# EAGLE design iot-gateway-usb-pd (EAGLE 9.6.1)
CNAME: PepeTech; CREVISION: 1.0; DESIGNER: Joao Silva
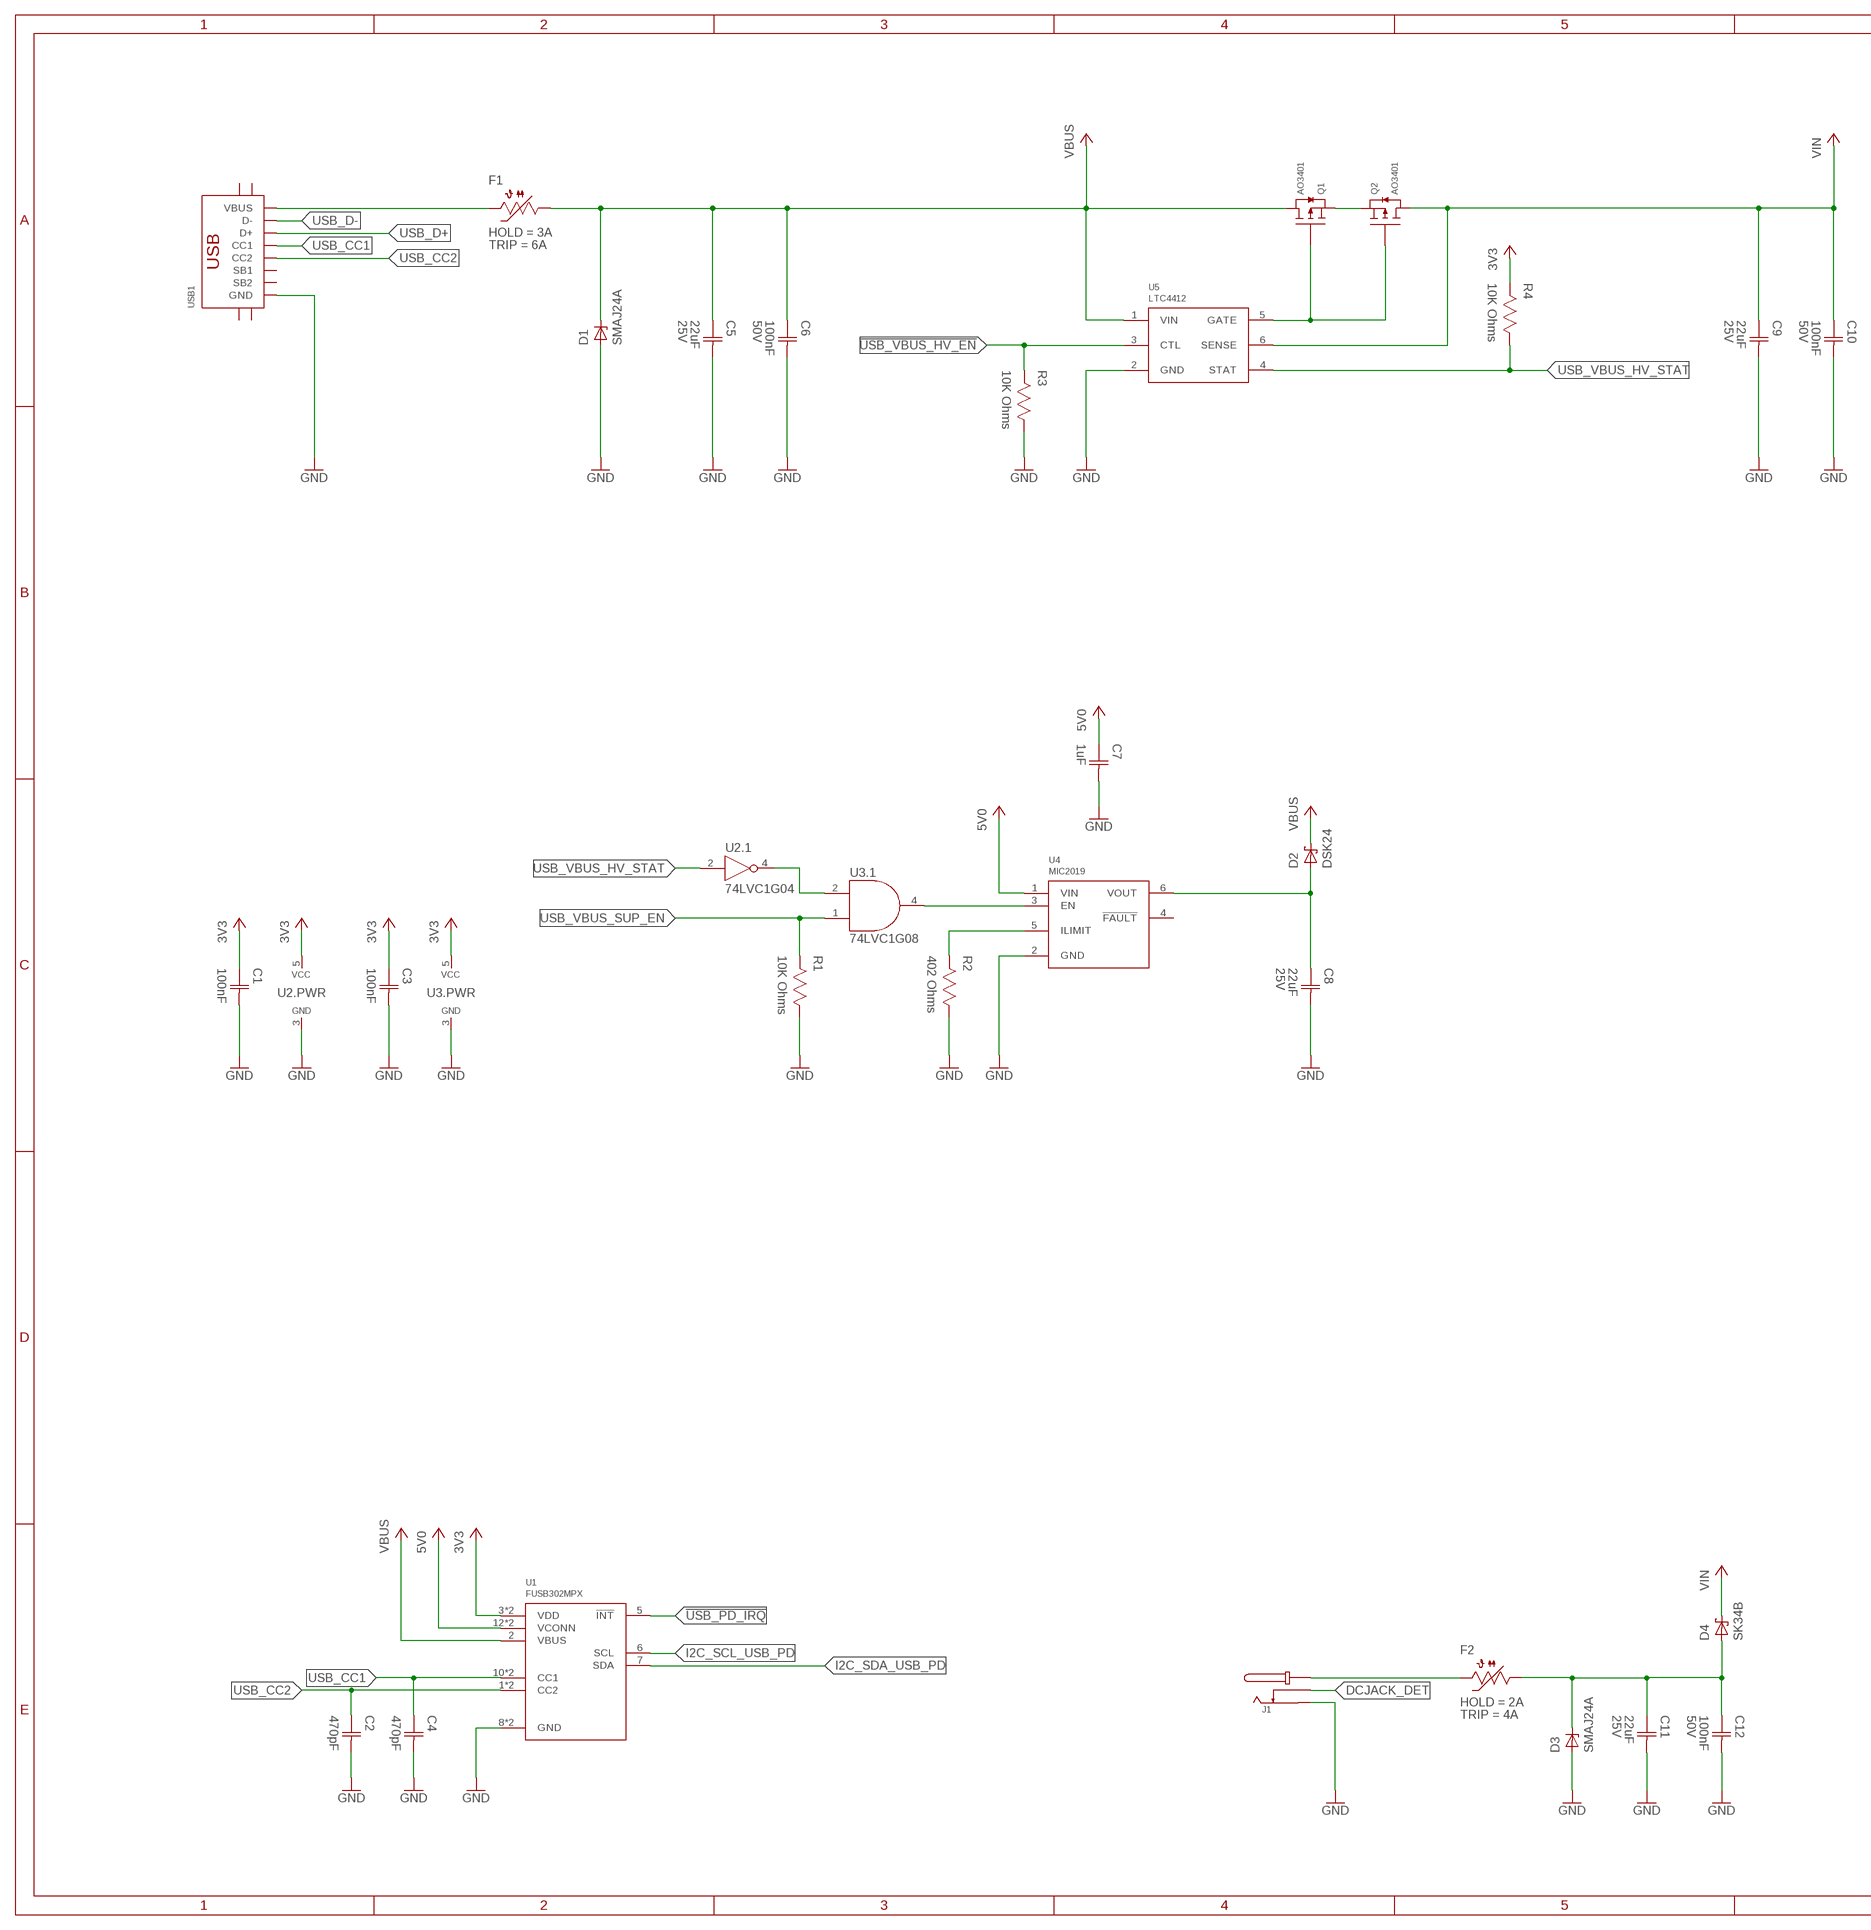
[diagram p0: schematic, sheet 1, part 1 of 2]
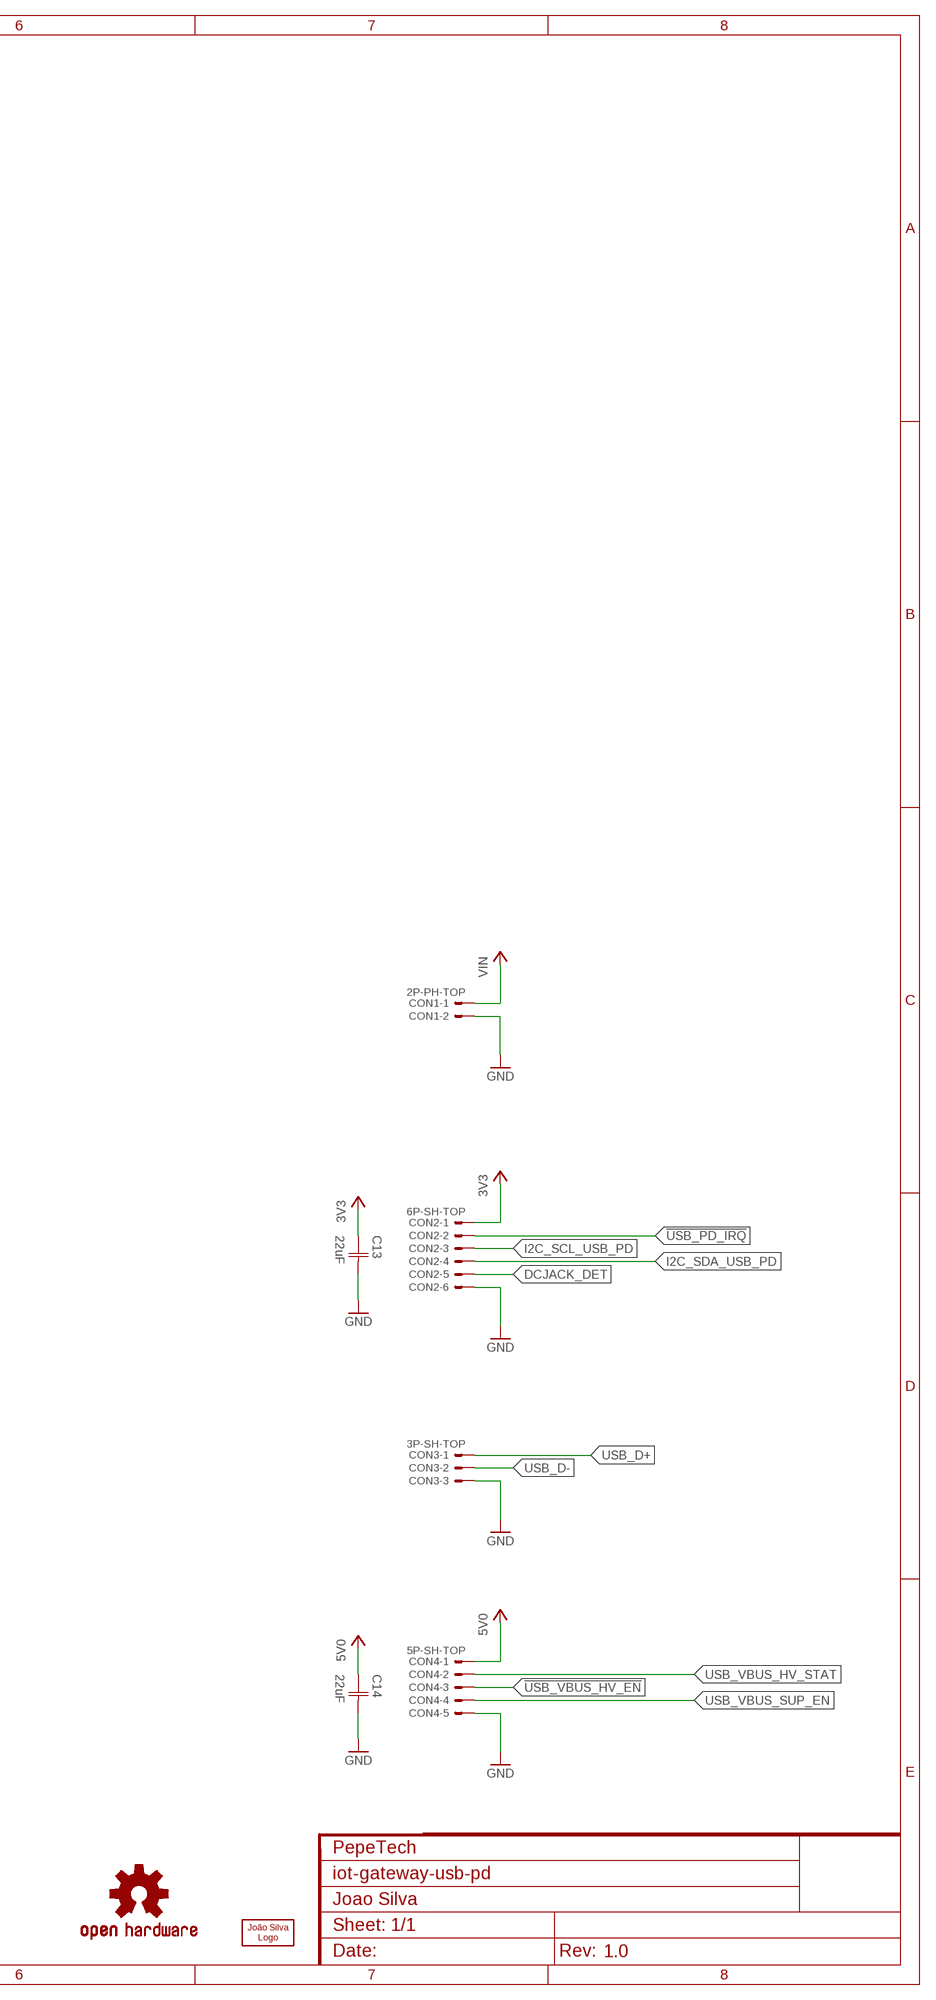
[diagram p1: schematic, sheet 1, part 2 of 2]

## Parts
C1  100nF  CAPACITOR-0603  [CAP0603]
C2  470pF  CAPACITOR-0603  [CAP0603]
C3  100nF  CAPACITOR-0603  [CAP0603]
C4  470pF  CAPACITOR-0603  [CAP0603]
C5  22uF  CAPACITOR-1206  [CAP1206]
C6  100nF  CAPACITOR-0603  [CAP0603]
C7  1uF  CAPACITOR-0603  [CAP0603]
C8  22uF  CAPACITOR-1206  [CAP1206]
C9  22uF  CAPACITOR-1206  [CAP1206]
C10  100nF  CAPACITOR-0603  [CAP0603]
C11  22uF  CAPACITOR-1206  [CAP1206]
C12  100nF  CAPACITOR-0603  [CAP0603]
C13  22uF  CAPACITOR-1206  [CAP1206]
C14  22uF  CAPACITOR-1206  [CAP1206]
CON1  2P-PH-TOP  [PH-02-TOP]
CON2  6P-SH-TOP  [SH-06-TOP]
CON3  3P-SH-TOP  [SH-03-TOP]
CON4  5P-SH-TOP  [SH-05-TOP]
D1  SMAJ24A  [DO214AC]
D2  DSK24  [SOD-123F]
D3  SMAJ24A  [DO214AC]
D4  SK34B  [DO214AA]
F1  PTC1206  [1206]
F2  PTC1206  [1206]
J1  DCJACK  [DC-050]
LOGO1  OSHW-LOGOS  [OSHW-LOGO-S]
LOGO2  JS-5MM  [JS_5MM]
Q1  AO3401  [SOT23]
Q2  AO3401  [SOT23]
R1  10K Ohms  RESISTOR-0603  [RES0603]
R2  402 Ohms  RESISTOR-0603  [RES0603]
R3  10K Ohms  RESISTOR-0603  [RES0603]
R4  10K Ohms  RESISTOR-0603  [RES0603]
U1  FUSB302MPX  [QFN14]
U2  74LVC1G04  [SC70-5]
U3  74LVC1G08  [SC70-5]
U4  MIC2019  [SOT23-6]
U5  LTC4412  [SOT23-6]
USB1  USB-C-16P-SMD-FLAT-SIDE-TYPE-2  [USB-C-16P-SMD-FLAT-SIDE-TYPE-2]

## Nets
3V3: C1.1(C1) C3.1(C1) C13.1(C1) CON2.1 R4.2 U1.3(VDD) U1.4(VDD) U2.5(.PWR:VCC) U3.5(.PWR:VCC)
5V0: C7.1(C1) C14.1(C1) CON4.1 U1.12(VCONN) U1.13(VCONN) U4.1(VIN)
!USB_PD_IRQ: CON2.2 U1.5(!INT)
!USB_VBUS_HV_EN: CON4.3 R3.2 U5.3(CTL)
!USB_VBUS_HV_STAT: U2.4(.1:Y) U3.2(.1:A)
DCJACK_DET: CON2.5 J1.DT
GND: C1.2(C2) C2.2(C2) C3.2(C2) C4.2(C2) C5.2(C2) C6.2(C2) C7.2(C2) C8.2(C2) C9.2(C2) C10.2(C2) C11.2(C2) C12.2(C2) C13.2(C2) C14.2(C2) CON1.2 CON2.6 CON3.3 CON4.5 D1.A D3.A J1.O R1.1 R2.1 R3.1 U1.8(GND) U1.9(GND) U2.3(.PWR:GND) U3.3(.PWR:GND) U4.2(GND) U5.2(GND) USB1.A1/B12(GND) USB1.B1/A12(GND)
I2C_SCL_USB_PD: CON2.3 U1.6(SCL)
I2C_SDA_USB_PD: CON2.4 U1.7(SDA)
N$3: Q1.2(S) Q2.2(S)
N$4: Q1.1(G) Q2.1(G) U5.5(GATE)
N$9: R2.2 U4.5(ILIMIT)
USB_CC1: C4.1(C1) U1.10(CC1) U1.11(CC1) USB1.A5(CC1)
USB_CC2: C2.1(C1) U1.1(CC2) U1.14(CC2) USB1.B5(CC2)
USB_D+: CON3.1 USB1.A6(D+) USB1.B6(D+)
USB_D-: CON3.2 USB1.A7(D-) USB1.B7(D-)
USB_VBUS_HV_STAT: CON4.2 R4.1 U2.2(.1:A) U5.4(STAT)
USB_VBUS_SUP_EN: CON4.4 R1.2 U3.1(.1:B)
USB_VBUS_SUP_EN_Q: U3.4(.1:Y) U4.3(EN)
VBUS: C5.1(C1) C6.1(C1) D1.C D2.C F1.1 Q1.3(D) U1.2(VBUS) U5.1(VIN)
VBUS_SRC: C8.1(C1) D2.A U4.6(VOUT)
VBUS_UNFUSED: F1.2 USB1.A4/B9(VBUS) USB1.B4/A9(VBUS)
VIN: C9.1(C1) C10.1(C1) CON1.1 D4.C Q2.3(D) U5.6(SENSE)
VJACK: C11.1(C1) C12.1(C1) D3.C D4.A F2.1
VJACK_UNFUSED: F2.2 J1.C J1.C'(C)
Unconnected: U4.4(!FAULT) USB1.A8(SB1) USB1.B8(SB2) USB1.SHIELD@0(SHIELD) USB1.SHIELD@1(SHIELD) USB1.SHIELD@2(SHIELD) USB1.SHIELD@3(SHIELD)

## Library data of the parts
C1-C4 C7 C13 C14 = Capacitor:CAPACITOR
C5 C8 C9 C11 = Capacitor:CAPACITOR; VOLTAGE: 25V
C6 C10 C12 = Capacitor:CAPACITOR; VOLTAGE: 50V
CON1 = JST:2P: Disconnectable Crimp style connector, 1.0mm pitch 2 contacts
CON2 = JST:6P: Disconnectable Crimp style connector, 1.0mm pitch 6 contacts
CON3 = JST:3P: Disconnectable Crimp style connector, 1.0mm pitch 3 contacts
CON4 = JST:5P: Disconnectable Crimp style connector, 1.0mm pitch 5 contacts
D1 D3 = TVS:SMAJ*A: SMAJ Series TVS Diodes Source: http://www.littelfuse.com/~/media/electronics/datasheets/tvs_diodes/littelfuse_tvs_diode_smaj_datasheet.pdf.pdf; MF: Littelfuse; MPN: SMAJ24A; OC_FARNELL: 1886345; OC_NEWARK: 06R1865
D2 = Generic Diode:DSK24
D4 = Generic Diode:SK34B
F1 = PTC Fuses:PTC; HOLD: 3A; OCLCSC: C207041; TRIP: 6A
F2 = PTC Fuses:PTC; HOLD: 2A; OCLCSC: C207216; TRIP: 4A
J1 = DC Jack:DCJACK
LOGO1 = Silkscreen:OSHW-LOGO: Open-Source Hardware (OSHW) Logo This logo indicates the piece of hardware it is found on incorporates a OSHW license and/or adheres to the definition of open source hardware found here: http://freedomdefined.org/OSHW
LOGO2 = Silkscreen:JS
Q1 Q2 = Alpha Omega:AO3401
R1-R4 = Resistor:RESISTOR
U1 = ON Semiconductor:FUSB302MPX
U2 = Logic:74LVC1G04
U3 = Logic:74LVC1G08
U4 = Microchip:MIC20*9
U5 = Analog Devices:LTC4412
USB1 = USB Connector:USB-C-16P-SMD-FLAT-SIDE

## Board
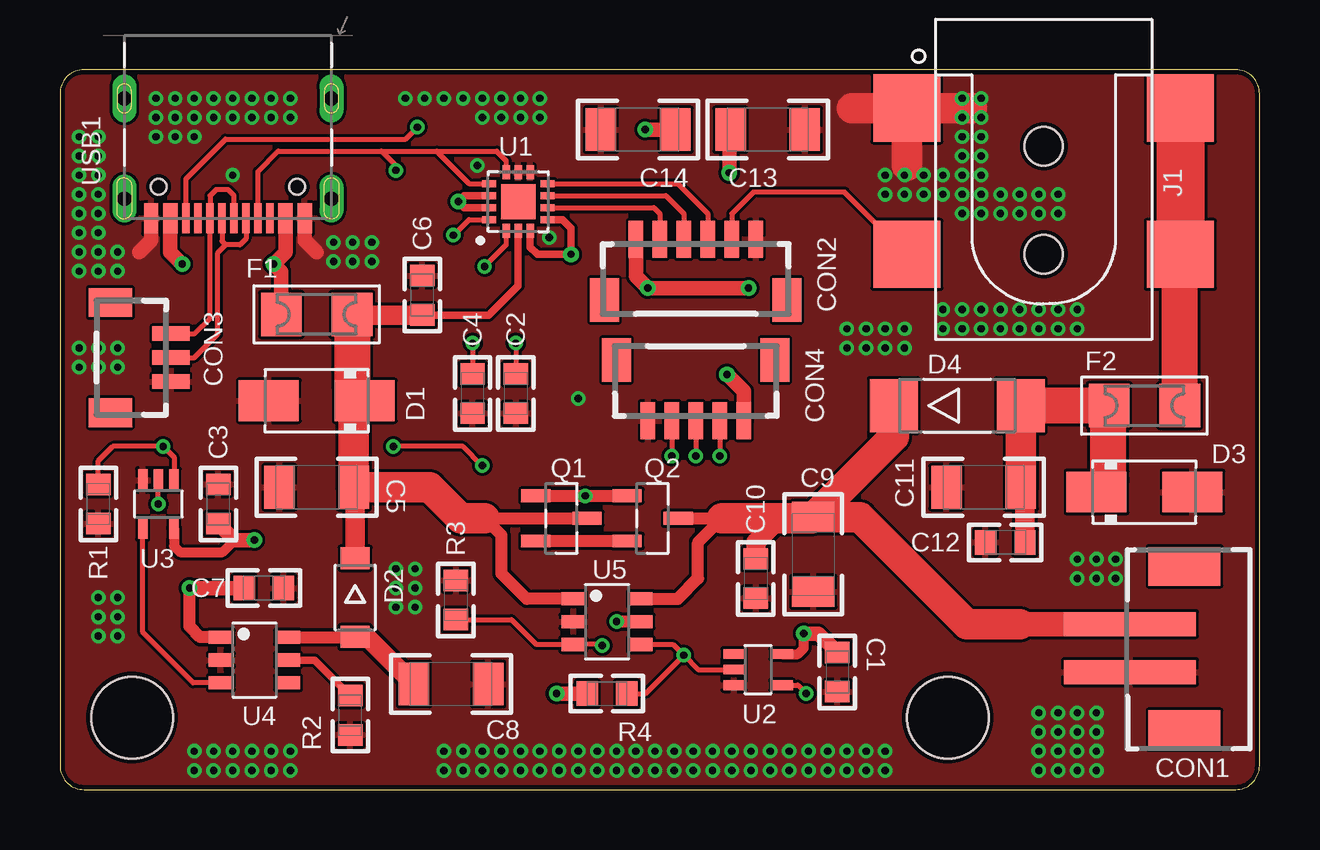
[diagram p2: board, top side]
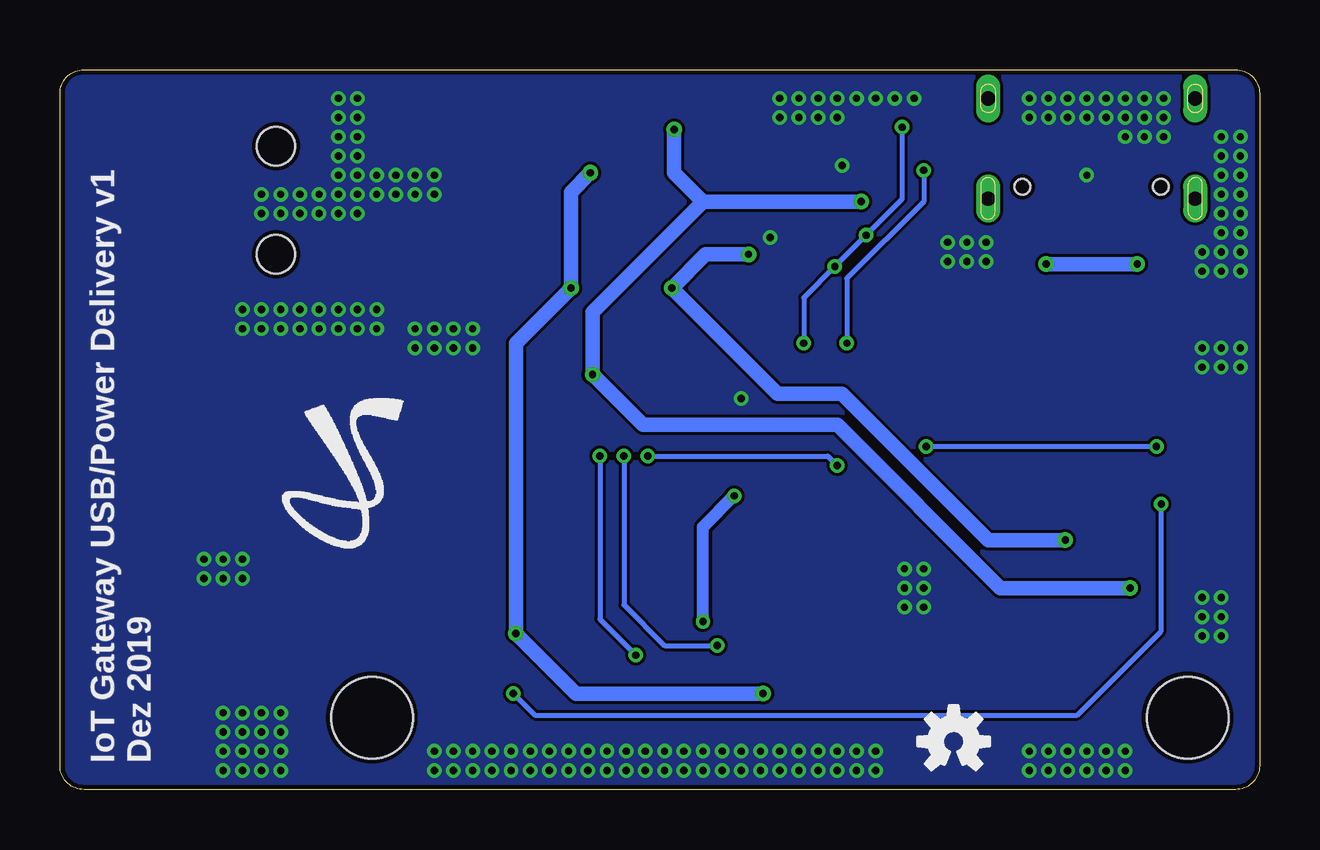
[diagram p3: board, bottom side, seen from below]

Size 50 x 30 mm. Coordinates in mm from the lower left corner, seen from the top.
Outline: 0,29 0,1 arc90 1,0 49,0 arc90 50,1 50,29 arc90 49,30 1,30 arc90 0,29
Copper layers (1*16): Top 0.035mm / dielectric 1.6mm / Bottom 0.035mm
Design rules "jlcpcb_2layer": minimum track width 5mil, minimum drill 0.3mm, track to track 5mil, track to pad 5mil, pad to pad 5mil, via to via 5mil, smd to smd 5mil, copper to edge 0.2mm, drill to drill 5mil, minimum pad ring 3mil, minimum via ring 3mil, stop-mask expansion 0.075mm, vias tented up to drill 10mm, thermal gap 5mil
Holes 3.4 mm at 3,3 37,3
tKeepout: area 0.5,0.5 to 5.5,5.5; area 34.5,0.5 to 39.5,5.5

### Footprints (pad centres in the part's own frame; a part is rotated, then mirrored left to right if it is on the bottom)
CAP0603 = smd 0.889 x 1.016: 1 -0.819,0; 2 0.819,0
CAP1206 = smd 1.27 x 1.778: 1 -1.549,0; 2 1.549,0
PH-02-TOP = smd 1 x 5.5: 1 -1,-2; 2 1,-2 | smd 1.6 x 3: P$1 -3.4,0.27; P$2 3.4,0.27
SH-06-TOP = smd 0.6 x 1.55: 1 2.5,-1.625; 2 1.5,-1.625; 3 0.5,-1.625; 4 -0.5,-1.625; 5 -1.5,-1.625; 6 -2.5,-1.625 | smd 1.2 x 1.8: FIT@1 3.8,0.9; FIT@2 -3.8,0.9
SH-03-TOP = smd 0.6 x 1.55: 1 1,-1.625; 2 0,-1.625; 3 -1,-1.625 | smd 1.2 x 1.8: FIT@1 2.3,0.9; FIT@2 -2.3,0.9
SH-05-TOP = smd 0.6 x 1.55: 1 2,-1.625; 2 1,-1.625; 3 0,-1.625; 4 -1,-1.625; 5 -2,-1.625 | smd 1.2 x 1.8: FIT@1 3.3,0.9; FIT@2 -3.3,0.9
DO214AC = smd 2.5 x 1.7: A 2,0; C -2,0
SOD-123F = smd 0.91 x 1.22: A 1.637,0; C -1.637,0
DO214AA = smd 2 x 2.2: A 2.65,0; C -2.65,0
1206 = smd 1.7 x 1.803: 1 -1.472,0; 2 1.472,0
DC-050 = smd 2.8 x 2.8: C 5.7,3.05; C' 5.7,-3.05; DT -5.7,-3.05; O -5.7,3.05 | hole 1.6: 0,-3.05; 0,1.45
SOT23 = smd 1.219 x 0.533: 1 -1.067,0.94; 2 -1.067,-0.94; 3 1.067,0
RES0603 = smd 0.889 x 1.016: 1 -0.819,0; 2 0.819,0
QFN14 = smd 0.58 x 0.3: 1 -1.215,0.5; 2 -1.215,0; 3 -1.215,-0.5; 8 1.215,-0.5; 9 1.215,0; 10 1.215,0.5 | smd 0.3 x 0.58: 4 -0.75,-1.215; 5 -0.25,-1.215; 6 0.25,-1.215; 7 0.75,-1.215; 11 0.75,1.215; 12 0.25,1.215; 13 -0.25,1.215; 14 -0.75,1.215 | smd 1.45 x 1.45: 15 0,0
SC70-5 = smd 0.4 x 0.9: 1 -0.65,-1; 2 0,-1; 3 0.65,-1; 4 0.65,1; 5 -0.65,1
SOT23-6 = smd 1 x 0.55: 1 -1.4,0.95; 2 -1.4,0; 3 -1.4,-0.95; 4 1.4,-0.95; 5 1.4,0; 6 1.4,0.95
USB-C-16P-SMD-FLAT-SIDE-TYPE-2 = smd 1.25 x 0.6: A1/B12 5,3.2; A4/B9 5,2.4; B1/A12 5,-3.2; B4/A9 5,-2.4 | smd 1.25 x 0.3: A5 5,1.25; A6 5,0.25; A7 5,-0.25; A8 5,-1.25; B5 5,-1.75; B6 5,-0.75; B7 5,0.75; B8 5,1.75 | drill 0.6 pad 1 long: SHIELD@0 0,4.32; SHIELD@1 4.18,4.32; SHIELD@2 4.18,-4.32; SHIELD@3 0,-4.32 | hole 0.65: 3.68,2.89; 3.68,-2.89

### Placement (x,y rotation side)
C1  32.4,4.9 270 top
C2  19,16.5 270 top
C3  6.6,11.9 90 top
C4  17.2,16.5 270 top
C5  10.7,12.6 180 top
C6  15.1,20.6 90 top
C7  8.5,8.4 0 top
C8  16.3,4.4 0 top
C9  31.4,9.8 270 top
C10  29,8.8 270 top
C11  38.5,12.6 180 top
C12  39.4,10.3 180 top
C13  29.5,27.5 0 top
C14  24.1,27.5 180 top
CON1  46.6,5.9 270 top
CON2  26.5,21.3 180 top
CON3  3,18 90 top
CON4  26.5,17 0 top
D1  10.7,16.2 180 top
D2  12.3,8 270 top
D3  45.2,12.4 0 top
D4  37.4,16 0 top
F1  10.7,19.8 180 top
F2  45.2,16 0 top
J1  41,25.35 0 top
LOGO1  12.75,2 0 bottom
LOGO2  35.5,16.5 0 bottom
Q1  20.9,11.3 0 top
Q2  24.7,11.3 0 top
R1  1.6,11.9 90 top
R2  12.1,3.1 90 top
R3  16.5,7.9 270 top
R4  22.8,4 180 top
U1  19.1,24.5 90 top
U2  29.1,5 270 top
U3  4.1,11.9 180 top
U4  8.1,5.4 0 top
U5  22.8,7 0 top
USB1  7,28.8 270 top

### Tracks (layer width: path | path; a pad name or v marks a point on that pad's centre or on a via)
3V3  (via drill 0.3 pad 0.65)
  Top 0.305: U1.3 19.6,22.6 19.9,22.3 v21.3,22.3 21.3,23.4 20.95,23.75 U1.4
  Top 0.406: U2.5 30.75,5.65 31,5.9 v31,6.5 | U3.5 4.75,10.15 5,9.9 6.78,9.9 7.28,10.4
  Top 0.61: CON2.1 24,21.4 v24.5,20.9 v28.7,20.9 | v27.9,25.7 27.9,27.45 C13.1 | v31,6.5 31.62,6.5 C1.1 | v20.7,4 R4.2 | v8.1,10.4 7.28,10.4 C3.1
  Bottom 0.61: v21.3,22.3 23.1,22.3 v24.5,20.9 20.1,16.5 17.4,16.5 11.3,10.4 v8.1,10.4 | v27.9,25.7 28.7,24.9 v28.7,20.9 31,18.6 v31,6.5 28.5,4 v20.7,4
5V0  (via drill 0.3 pad 0.65)
  Top 0.305: U1.12 16.85,24.75 v16.6,24.5 16.85,24.25 U1.13
  Top 0.508: U4.1 5.85,6.35 5.4,6.8 v5.4,8.4
  Top 0.61: CON4.1 28.5,16.6 v27.8,17.3 | v24.4,27.5 C14.1 | v5.4,8.4 C7.1
  Bottom 0.61: v16.6,24.5 23.2,24.5 | 23.2,24.5 27.8,19.9 v27.8,17.3 25.7,15.2 17.6,15.2 10.8,8.4 v5.4,8.4 | 23.2,24.5 24.4,25.7 v24.4,27.5
!USB_PD_IRQ
  Top 0.2: U1.5 24.75,24.25 25,24 CON2.2
!USB_VBUS_HV_EN  (via drill 0.3)
  Top 0.2: CON4.3 v26.5,13.9 | v22.6,6 22.55,6.05 U5.3 19.85,6.05 18.82,7.08 R3.2
  Bottom 0.2: v26.5,13.9 26.5,7.7 24.8,6 v22.6,6
!USB_VBUS_HV_STAT  (via drill 0.3)
  Top 0.2: U2.4 30.75,4.35 v31.1,4 | v4.1,11.9 U3.2
  Bottom 0.2: v31.1,4 30.2,3.1 7.6,3.1 4.1,6.6 v4.1,11.9
DCJACK_DET
  Top 0.2: J1.DT 32.7,24.9 28.9,24.9 28,24 CON2.5
GND  (via drill 0.3)
  Top 0.61: USB1.A1/B12 10.2,22.9 10.7,22.4 | USB1.B1/A12 3.8,22.9 3.3,22.4
  Top 1.27: J1.O 38,28.4 | J1.O 35.3,26 | J1.O 33,28.4
  other vias: 28,0.8 28,1.6 27.2,1.6 27.2,0.8 26.4,0.8 26.4,1.6 25.6,1.6 25.6,0.8 18.4,0.8 18.4,1.6 17.6,1.6 17.6,0.8 16.8,0.8 16.8,1.6 16,1.6 16,0.8 21.6,0.8 21.6,1.6 20.8,1.6 20.8,0.8 20,0.8 20,1.6 19.2,1.6 19.2,0.8 24.8,0.8 24.8,1.6 24,1.6 24,0.8 23.2,0.8 23.2,1.6 22.4,1.6 22.4,0.8 31.2,0.8 31.2,1.6 30.4,1.6 30.4,0.8 29.6,0.8 29.6,1.6 28.8,1.6 28.8,0.8 34.4,0.8 34.4,1.6 33.6,1.6 33.6,0.8 32.8,0.8 32.8,1.6 32,1.6 32,0.8 43.2,2.4 43.2,3.2 42.4,3.2 42.4,2.4 41.6,2.4 41.6,3.2 40.8,3.2 40.8,2.4 43.2,0.8 43.2,1.6 42.4,1.6 42.4,0.8 41.6,0.8 41.6,1.6 40.8,1.6 40.8,0.8 37.6,28.8 38.4,28.8 38.4,28 37.6,28 37.6,27.2 38.4,27.2 38.4,26.4 37.6,26.4 37.6,25.6 38.4,25.6 38.4,24.8 37.6,24.8 37.6,24 38.4,24 36.8,24.8 36.8,25.6 36,25.6 36,24.8 35.2,24.8 35.2,25.6 34.4,25.6 34.4,24.8 17.6,28.8 17.6,28 18.4,28 18.4,28.8 19.2,28.8 19.2,28 20,28 20,28.8 41.6,24 41.6,24.8 40.8,24.8 40.8,24 40,24 40,24.8 39.2,24.8 39.2,24 32.8,19.2 32.8,18.4 33.6,18.4 33.6,19.2 34.4,19.2 34.4,18.4 35.2,18.4 35.2,19.2 42.4,19.2 42.4,20 41.6,20 41.6,19.2 40.8,19.2 40.8,20 40,20 40,19.2 39.2,19.2 39.2,20 38.4,20 38.4,19.2 37.6,19.2 37.6,20 36.8,20 36.8,19.2 9.6,28 9.6,28.8 8.8,28.8 8.8,28 8,28 8,28.8 4,28.8 4,28 7.2,28 7.2,28.8 6.4,28.8 6.4,28 5.6,28 5.6,28.8 4.8,28.8 4.8,28 4,27.2 5.6,27.2 4.8,27.2 7.2,25.6 1.6,24.8 0.8,24.8 0.8,24 1.6,24 1.6,23.2 0.8,23.2 1.6,27.2 0.8,27.2 0.8,26.4 1.6,26.4 1.6,25.6 0.8,25.6 2.4,17.6 2.4,18.4 1.6,18.4 1.6,17.6 0.8,17.6 0.8,18.4 2.4,8 1.6,8 1.6,7.2 2.4,7.2 2.4,6.4 1.6,6.4 9.6,0.8 9.6,1.6 8.8,1.6 8.8,0.8 8,0.8 8,1.6 7.2,0.8 7.2,1.6 6.4,1.6 6.4,0.8 5.6,0.8 5.6,1.6 14.8,9.2 14,9.2 14,8.4 14.8,8.4 14.8,7.6 14,7.6 44,8.8 44,9.6 43.2,9.6 43.2,8.8 42.4,8.8 42.4,9.6 13,22 13,22.8 12.2,22.8 12.2,22 11.4,22 11.4,22.8 2.4,21.6 2.4,22.4 1.6,22.4 1.6,21.6 0.8,21.6 0.8,22.4 14.4,28.8 15.2,28.8 16,28.8 16.8,28.8 21.6,16.3 17.4,26 20.4,23
  pour Top (rank 6): -1,-1 -1,31 51,31 51,-1
  pour Bottom (rank 6): -2,-2 52,-2 52,32 -2,32
I2C_SCL_USB_PD
  Top 0.2: U1.6 25.25,24.75 26,24 CON2.3
I2C_SDA_USB_PD
  Top 0.2: U1.7 25.75,25.25 27,24 CON2.4
N$3
  Top 0.508: Q1.2 Q2.2
N$4  (via drill 0.3)
  Top 0.508: Q1.1 v21.9,12.24 Q2.1 | U5.5 v23.2,7
  Bottom 0.508: v23.2,7 23.2,10.94 v21.9,12.24
N$9
  Top 0.305: U4.5 10.62,5.4 R2.2
USB_CC1  (via drill 0.3)
  Top 0.2: USB1.A5 8.25,25.75 9.1,26.6 13.4,26.6 | 13.4,26.6 15.7,26.6 | U1.11 17.05,25.25 15.7,26.6 | 15.7,26.6 18.2,26.6 18.6,26.2 U1.10 | 13.4,26.6 14,26 v14,25.8 | v17.2,18.6 C4.1
  Bottom 0.2: v14,25.8 14,24.5 17.2,21.3 v17.2,18.6
USB_CC2  (via drill 0.3)
  Top 0.2: USB1.B5 5.25,25.45 6.9,27.1 14.4,27.1 v14.9,27.6 | v16.4,23.1 17.05,23.75 U1.14 | U1.1 18.6,22.7 v17.7,21.8 | v19,18.6 C2.1
  Bottom 0.2: v14.9,27.6 14.9,24.6 v16.4,23.1 v17.7,21.8 19,20.5 v19,18.6
USB_D+
  Top 0.2: CON3.1 5.6,19 6.25,19.65 USB1.B6 6.25,24.75 6.5,25 7,25 7.25,24.75 USB1.A6
USB_D-
  Top 0.2: CON3.2 5.6,18 6.58,18.98 6.58,22.38 6.9,22.7 | USB1.A7 6.75,22.85 6.9,22.7 | USB1.B7 7.75,22.95 7.5,22.7 6.9,22.7
USB_VBUS_HV_STAT  (via drill 0.3)
  Top 0.2: U5.4 25.55,6.05 v26,5.6 | U2.2 26.6,5 v26,5.6 | CON4.2 v27.5,13.9 | R4.1 24.4,4 v26,5.6
  Bottom 0.2: v27.5,13.9 27.5,7.1 v26,5.6
USB_VBUS_SUP_EN  (via drill 0.3)
  Top 0.2: R1.2 1.6,13.7 2.2,14.3 v4.3,14.3 4.75,13.85 U3.1 | CON4.4 v25.5,13.9 | v17.6,13.5 16.8,14.3 v13.9,14.3
  Bottom 0.2: v25.5,13.9 18,13.9 v17.6,13.5 | v13.9,14.3 v4.3,14.3
USB_VBUS_SUP_EN_Q
  Top 0.2: U4.3 5.55,4.45 3.45,6.55 U3.4
VBUS
  Top 0.254: C6.1
  Top 0.305: U1.2 19.1,21 17.87,19.77 C6.1
  Top 0.508: Q1.3 17.7,11.3 18.4,10.6 18.4,9 19.45,7.95 U5.1
  Top 0.813: C6.1 12.2,19.77 | D2.C 12.3,12.55 C5.1
  Top 1.27: D1.C 12.25,15.75 C5.1 15.4,12.6 16.7,11.3 17.7,11.3
  Top 1.5: F1.1 12.2,19.77 12.2,16.7 D1.C
VBUS_SRC
  Top 0.508: U4.6 12.29,6.35 D2.A
  Top 0.813: C8.1 12.8,6.35 12.29,6.35
VBUS_UNFUSED  (via drill 0.3 pad 0.65)
  Top 0.61: USB1.B4/A9 4.6,22.4 v5.1,21.9 | USB1.A4/B9 9.4,22.4 v8.9,21.9 9.23,21.57 F1.2
  Bottom 0.61: v8.9,21.9 v5.1,21.9
VIN
  Top 0.508: Q2.3 27.6,11.3 26.6,10.3 26.6,8.8 25.75,7.95 U5.6
  Top 0.813: C10.1 29,10.3 30,11.3
  Top 1.016: 40,6.9 CON1.1
  Top 1.27: C9.1 31.35,11.3 30,11.3 27.6,11.3 | C9.1 34.75,14.7 D4.C | C9.1 33.35,11.35 37.8,6.9 40,6.9
VJACK
  Top 0.813: C12.1 40.22,12.43 C11.1
  Top 1.27: C11.1 D4.A
  Top 1.5: D3.C 43.7,12.9 43.7,15.97 F2.1 D4.A
VJACK_UNFUSED
  Top 1.5: F2.2 46.67,22.27 J1.C'
  Top 2: J1.C J1.C'

### Text on the board
bPlace: IoT Gateway USB/Power Delivery v1 / Dez 2019